# EAGLE schematic triac_driver (EAGLE 6.6.0)
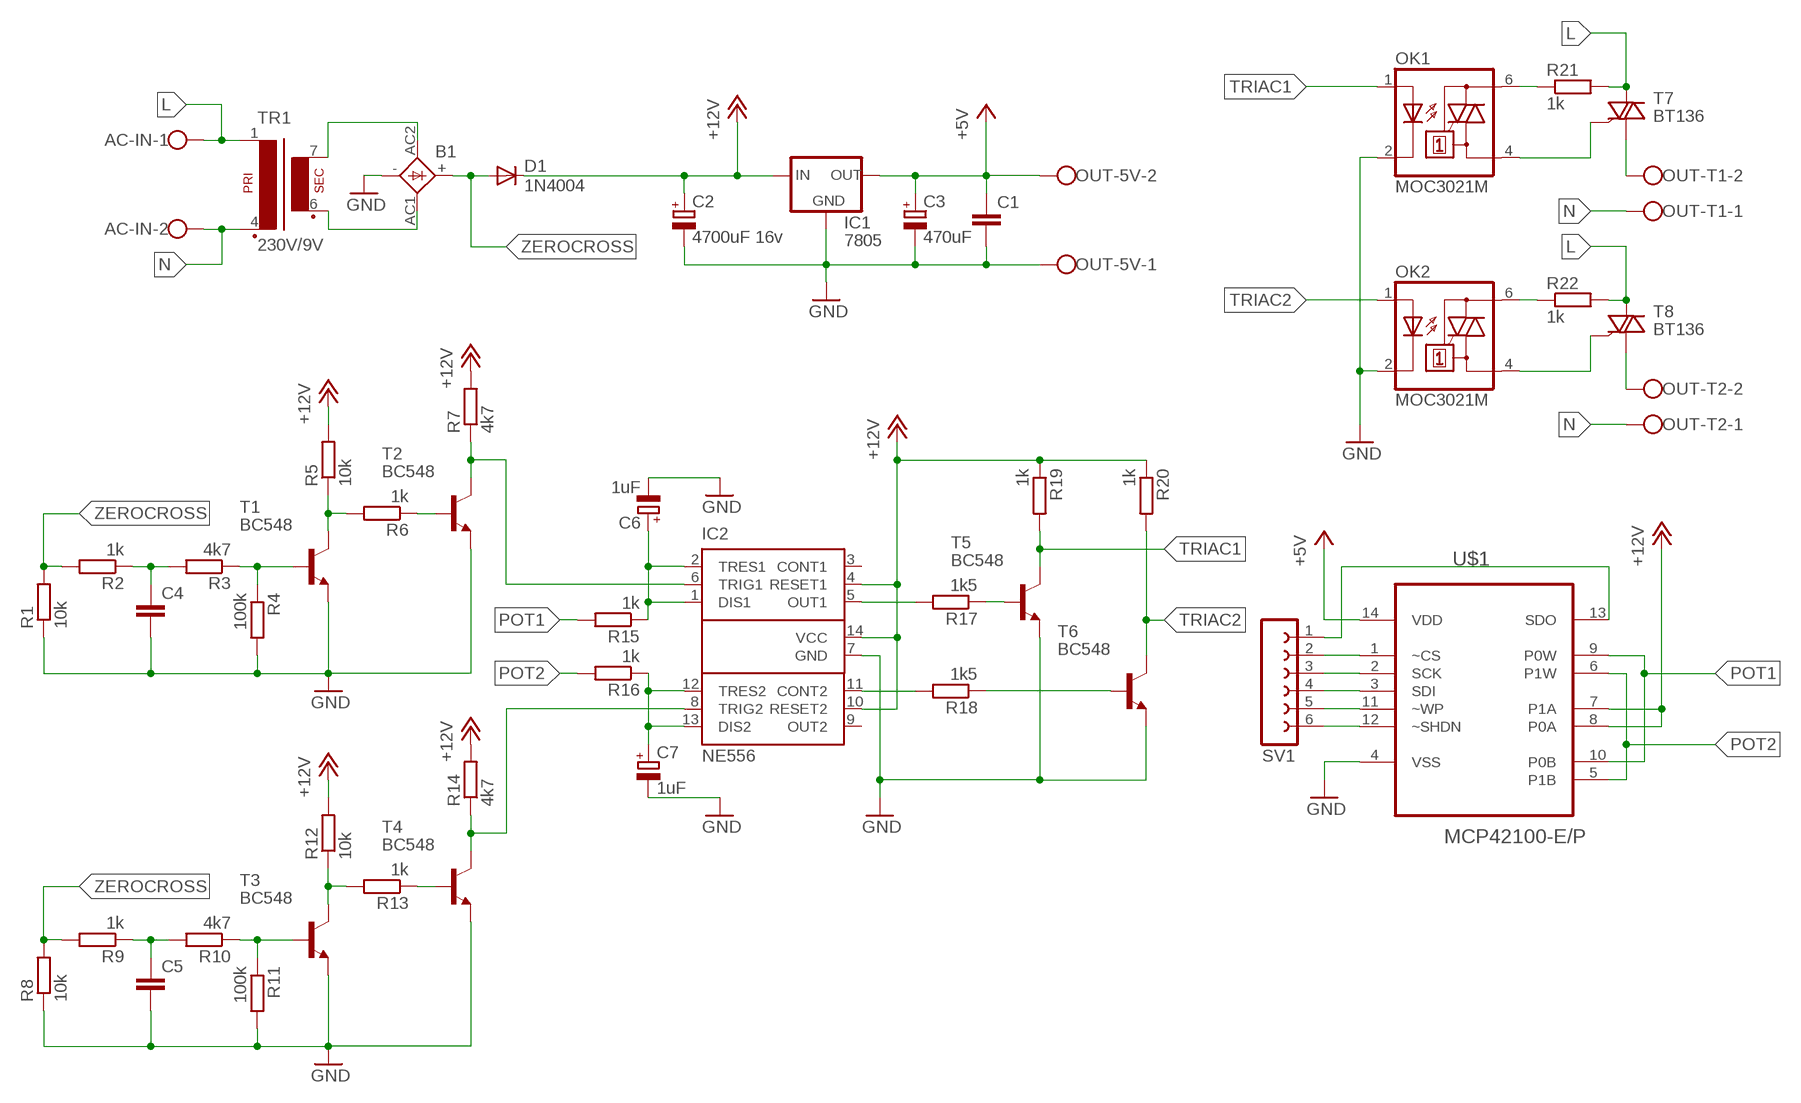
[diagram p0: schematic, sheet 1]

## Parts
AC-IN  W237-102  [W237-102]
B1  FBP1,5  [FBP1,5]
C1  C-EU025-060X050  [C025-060X050]
C2  4700uF 16v  CPOL-EUE3.5-8  [E3,5-8]
C3  470uF  CPOL-EUE3.5-8  [E3,5-8]
C4  C-EU025-060X050  [C025-060X050]
C5  C-EU025-060X050  [C025-060X050]
C6  1uF  CPOL-EUE3.5-8  [E3,5-8]
C7  1uF  CPOL-EUE3.5-8  [E3,5-8]
D1  1N4004  [DO41-10]
IC1  7805  78LXX  [78LXX]
IC2  NE556  [DIL14]
OK1  MOC3021M  [DIL06]
OK2  MOC3021M  [DIL06]
OUT-5V  W237-102  [W237-102]
OUT-T1  W237-102  [W237-102]
OUT-T2  W237-102  [W237-102]
R1  10k  R-EU_0204/7  [0204/7]
R2  1k  R-EU_0204/7  [0204/7]
R3  4k7  R-EU_0204/7  [0204/7]
R4  100k  R-EU_0204/7  [0204/7]
R5  10k  R-EU_0204/7  [0204/7]
R6  1k  R-EU_0204/7  [0204/7]
R7  4k7  R-EU_0204/7  [0204/7]
R8  10k  R-EU_0204/7  [0204/7]
R9  1k  R-EU_0204/7  [0204/7]
R10  4k7  R-EU_0204/7  [0204/7]
R11  100k  R-EU_0204/7  [0204/7]
R12  10k  R-EU_0204/7  [0204/7]
R13  1k  R-EU_0204/7  [0204/7]
R14  4k7  R-EU_0204/7  [0204/7]
R15  1k  R-EU_0204/7  [0204/7]
R16  1k  R-EU_0204/7  [0204/7]
R17  1k5  R-EU_0204/7  [0204/7]
R18  1k5  R-EU_0204/7  [0204/7]
R19  1k  R-EU_0204/7  [0204/7]
R20  1k  R-EU_0204/7  [0204/7]
R21  1k  R-EU_0204/7  [0204/7]
R22  1k  R-EU_0204/7  [0204/7]
SV1  FE06-1  [FE06]
T1  BC548  BC547  [TO92]
T2  BC548  BC547  [TO92]
T3  BC548  BC547  [TO92]
T4  BC548  BC547  [TO92]
T5  BC548  BC547  [TO92]
T6  BC548  BC547  [TO92]
T7  BT136  [TO220AB]
T8  BT136  [TO220AB]
TR1  230V/9V  EE20-1  [EE20-1]
U$1  MCP42100-E/P  MCP4241-103E/P  [DIP254P762X533-14]

## Nets
+5V: C1.1 C3.+ IC1.OUT OUT-5V.2 U$1.14(VDD)
+12V: C2.+ D1.C IC1.IN IC2.4(RESET1) IC2.10(RESET2) IC2.14(VCC) R5.2 R7.2 R12.2 R14.2 R19.1 R20.1 U$1.7(P1A) U$1.8(P0A)
GND: B1.- C1.2 C2.- C3.- C4.2 C5.2 C6.- C7.- IC1.GND IC2.7(GND) OK1.2(C) OK2.2(C) OUT-5V.1 R1.1 R4.2 R8.1 R11.2 T1.1(E) T2.1(E) T3.1(E) T4.1(E) T5.1(E) T6.1(E) U$1.4(VSS)
L: AC-IN.1 R21.2 R22.2 T7.2(A2) T8.2(A2) TR1.1
N: AC-IN.2 OUT-T1.1 OUT-T2.1 TR1.4(P2)
N$1: OK1.6(A2) R21.1
N$2: OUT-T1.2 T7.1(A1)
N$3: B1.AC2(AC1) TR1.7(S4)
N$4: B1.AC1(AC2) TR1.6(S3)
N$5: C4.1 R2.1 R3.2
N$6: R6.1 T2.2(B)
N$7: R5.1 R6.2 T1.3(C)
N$8: R3.1 R4.1 T1.2(B)
N$9: C5.1 R9.1 R10.2
N$10: R12.1 R13.2 T3.3(C)
N$11: R10.1 R11.1 T3.2(B)
N$12: R13.1 T4.2(B)
N$13: C7.+ IC2.12(TRES2) IC2.13(DIS2) R16.1
N$14: C6.+ IC2.1(DIS1) IC2.2(TRES1) R15.1
N$15: IC2.11(CONT2) R18.2
N$16: IC2.5(OUT1) R17.2
N$17: R17.1 T5.2(B)
N$18: R18.1 T6.2(B)
N$19: OK1.4(A1) T7.3(G)
N$20: SV1.6 U$1.12(~SHDN)
N$21: SV1.5 U$1.11(~WP)
N$22: OK2.6(A2) R22.1
N$23: OK2.4(A1) T8.3(G)
N$24: OUT-T2.2 T8.1(A1)
N$25: SV1.4 U$1.3(SDI)
N$26: SV1.3 U$1.2(SCK)
N$27: SV1.2 U$1.1(~CS)
N$28: SV1.1 U$1.13(SDO)
POT1: R15.2 U$1.9(P0W) U$1.10(P0B)
POT2: R16.2 U$1.5(P1B) U$1.6(P1W)
TRIAC1: OK1.1(A) R19.2 T5.3(C)
TRIAC2: OK2.1(A) R20.2 T6.3(C)
TRIGGER1: IC2.6(TRIG1) R7.1 T2.3(C)
TRIGGER2: IC2.8(TRIG2) R14.1 T4.3(C)
ZEROCROSS: B1.+ D1.A R1.2 R2.2 R8.2 R9.2
Unconnected: IC2.3(CONT1) IC2.9(OUT2)

## Library data of the parts
AC-IN OUT-5V OUT-T1 OUT-T2 = con-wago-500:W237-102: WAGO SCREW CLAMP; MPN: 237-102; OC_FARNELL: unknown; OC_NEWARK: 70K9898
B1 = rectifier:FBP1,5: FAGOR RECTIFIER grid 3 x 4 mm
C1 C4 C5 = rcl:C-EU: CAPACITOR, European symbol
C2 C3 C6 C7 = rcl:CPOL-EU: POLARIZED CAPACITOR, European symbol
D1 = adafruit:1N4004: DIODE General purpose 1N400x type rectifier (With bigger pads) http://www.ladyada.net/library/pcb/eaglelibrary.html
IC1 = v-reg:78LXX: VOLTAGE REGULATOR
IC2 = st-microelectronics:NE556: General Purpose Biopolartimer; MPN: NE556; OC_FARNELL: 2349784; OC_NEWARK: 83C0108
OK1 OK2 = optocoupler:MOC30*M: RANDOM-PHASE OPTOISOLATORS TRIAC DRIVER OUTPUT Source: http://www.fairchildsemi.com MOC3020-M.pdf; MF: FAIRCHILD SEMICONDUCTOR; MPN: MOC3021-M; OC_FARNELL: 1021365; OC_NEWARK: 95B7895
R1-R22 = rcl:R-EU_: RESISTOR, European symbol
SV1 = con-lsta:FE06-1: FEMALE HEADER; OC_FARNELL: unknown; OC_NEWARK: unknown
T1-T6 = transistor:BC547: NPN TRANSISTOR
T7 T8 = triac:BT136: Triac BT136 series E sensitive gate Source: http://www.nxp.com/acrobat_download/datasheets/BT136_SERIES_E_2.pdf
TR1 = trafo:EE20-1: TRANSFORMER 1 primary winding, 1 secondary winding ERA
U$1 = Webmaster442:MCP4241-103E/P: Digital POT; MPN: MCP4241-103E/P; OC_FARNELL: 1578439; OC_NEWARK: 08N6507; PACKAGE: DIP-14; SUPPLIER: Microchip